# Altium schematic sheet Power_Input_Indicators.SchDoc: Power Inputs and Indicators
size B; CheckedBy: Jason Sullins; Author: Jordan Harris-Toovy; Revision: 0.2; SheetNumber: 4; SheetTotal: 22; Size: ANSI B
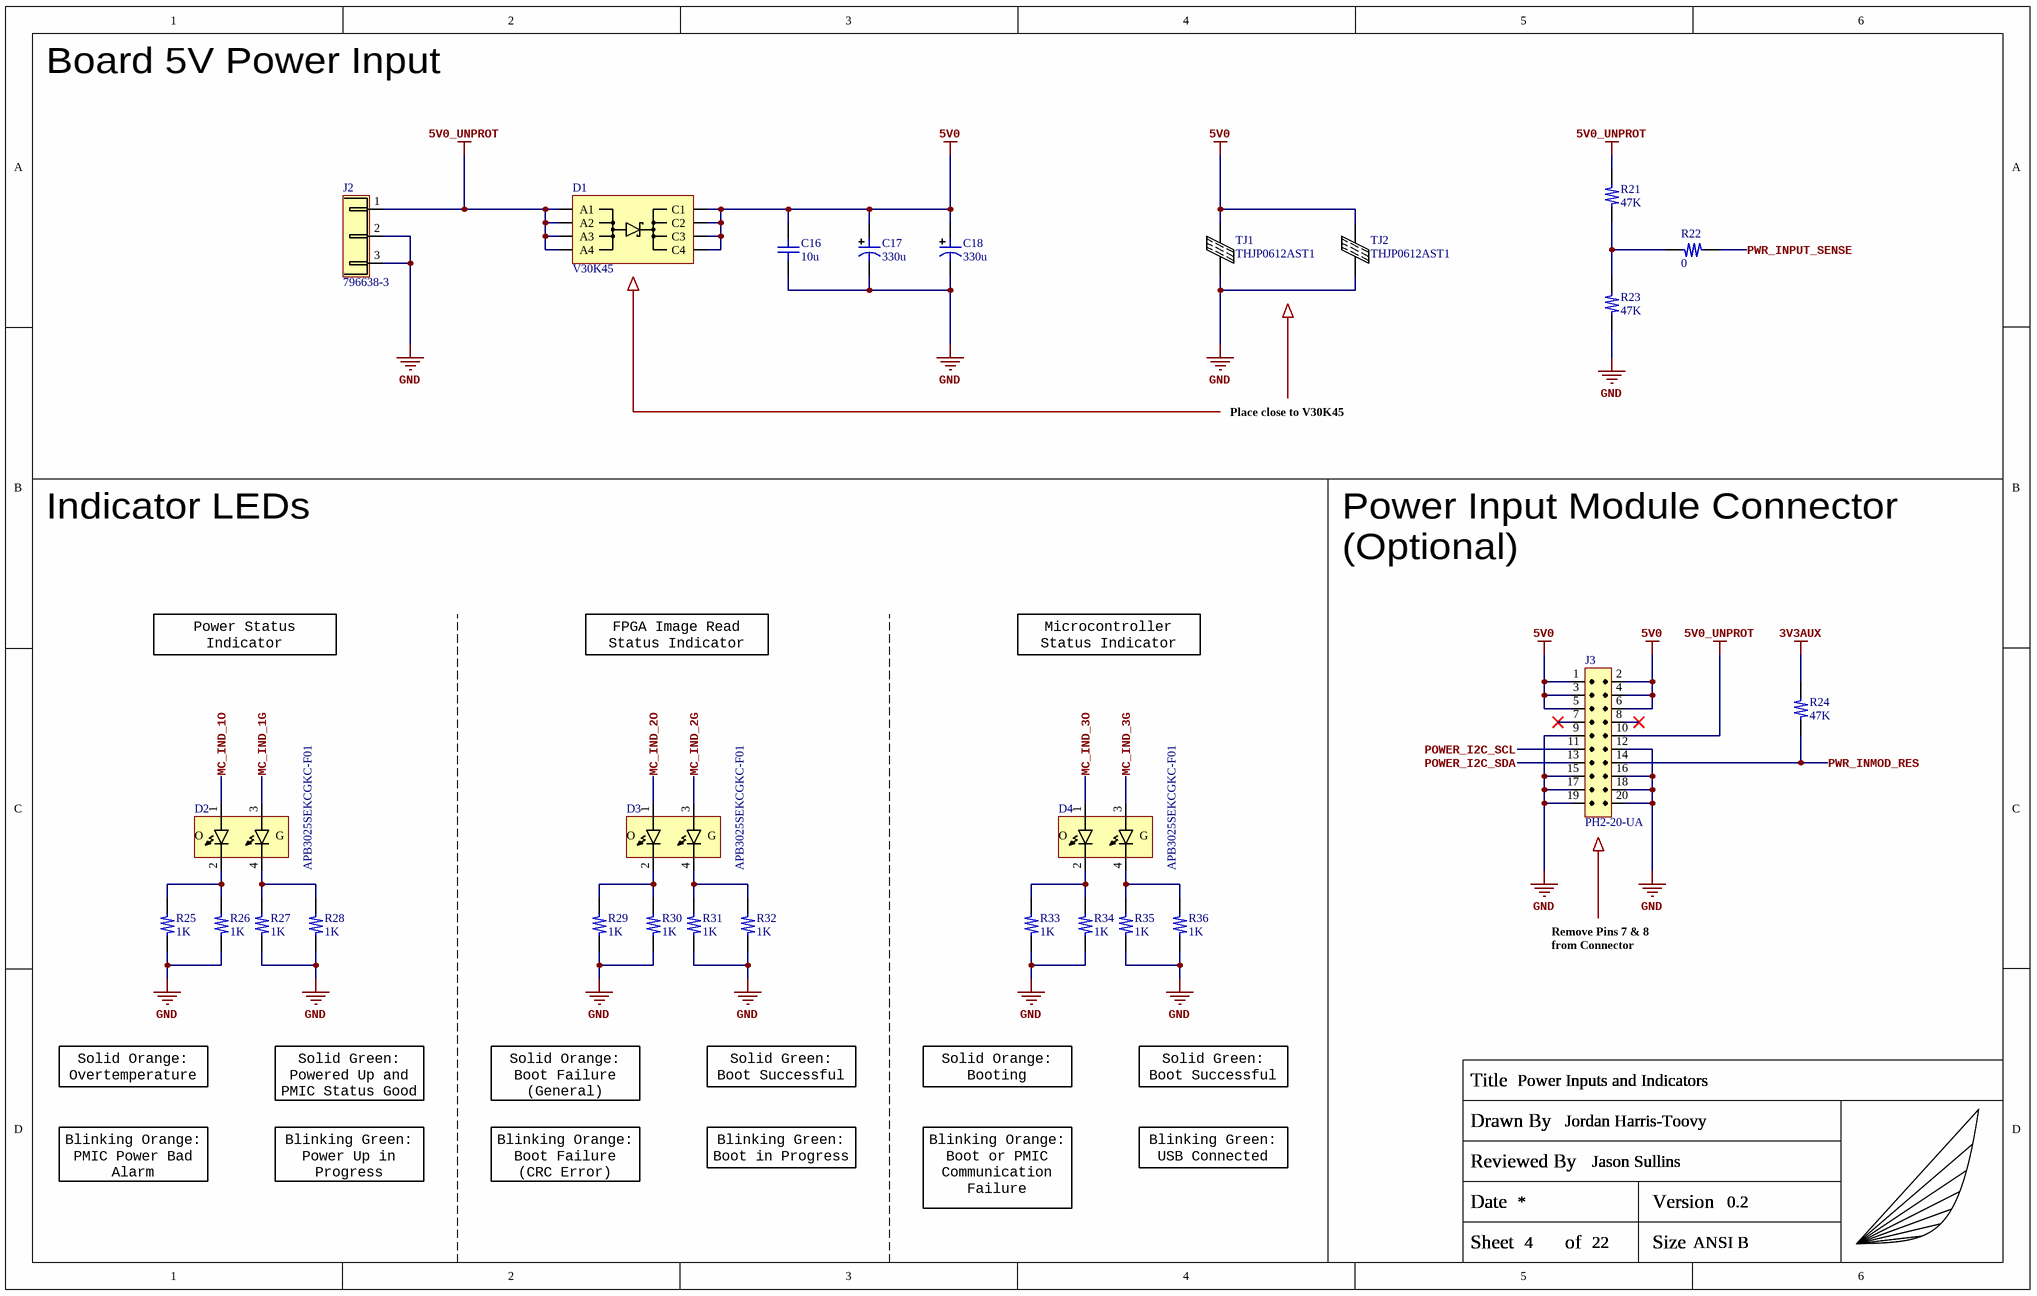
[diagram p0: Power_Input_Indicators.SchDoc]

## Parts
C16  10u  [C_0402_Generic]
C17  330u  [KEMET_EK_Radial]
C18  330u  [KEMET_EK_Radial]
D1  V30K45  [Vishay_FlatPAK_5x6]
D2  APB3025SEKCGKC-F01  [KINGBRIGHT_1210_DUAL]
D3  APB3025SEKCGKC-F01  [KINGBRIGHT_1210_DUAL]
D4  APB3025SEKCGKC-F01  [KINGBRIGHT_1210_DUAL]
J2  796638-3  [TE_796638-3]
J3  PH2-20-UA  [ADAM_TECH_PH2-20-UA]
R21  47K  [R_0402_Generic]
R22  0  [R_0402_Generic]
R23  47K  [R_0402_Generic]
R24  47K  [R_0402_Generic]
R25  1K  [R_0402_Generic]
R26  1K  [R_0402_Generic]
R27  1K  [R_0402_Generic]
R28  1K  [R_0402_Generic]
R29  1K  [R_0402_Generic]
R30  1K  [R_0402_Generic]
R31  1K  [R_0402_Generic]
R32  1K  [R_0402_Generic]
R33  1K  [R_0402_Generic]
R34  1K  [R_0402_Generic]
R35  1K  [R_0402_Generic]
R36  1K  [R_0402_Generic]
TITLEBLOCK?  Capstone_Title_Block  (value not drawn)  (graphical)
TJ1  THJP0612AST1  [ThermaWick_0612]
TJ2  THJP0612AST1  [ThermaWick_0612]

## Nets
3V3AUX: R24.2
5V0: C16.2 C17.1 C18.1 D1.5(C1) D1.6(C2) D1.7(C3) D1.8(C4) J3.1(P1) J3.2(P2) J3.3(P3) J3.4(P4) J3.5(P5) J3.6(P6) TJ1.2(P2) TJ2.2(P2)
5V0_UNPROT: D1.1(A1) D1.2(A2) D1.3(A3) D1.4(A4) J2.1(P1) J3.10(P10) R21.2
GND: C16.1 C17.2 C18.2 J2.2(P2) J2.3(P3) J3.9(P9) J3.12(P12) J3.15(P15) J3.16(P16) J3.17(P17) J3.18(P18) J3.19(P19) J3.20(P20) R23.1 R25.1 R26.1 R27.1 R28.1 R29.1 R30.1 R31.1 R32.1 R33.1 R34.1 R35.1 R36.1 TJ1.1(P1) TJ2.1(P1)
MC_IND_1G: D2.3(A2)
MC_IND_1O: D2.1(A1)
MC_IND_2G: D3.3(A2)
MC_IND_2O: D3.1(A1)
MC_IND_3G: D4.3(A2)
MC_IND_3O: D4.1(A1)
POWER_I2C_SCL: J3.11(P11)
POWER_I2C_SDA: J3.13(P13)
PWR_INMOD_RES: J3.14(P14) R24.1
PWR_INPUT_SENSE: R22.1
NetD2_2: D2.2(C1) R25.2 R26.2
NetD2_4: D2.4(C2) R27.2 R28.2
NetD3_2: D3.2(C1) R29.2 R30.2
NetD3_4: D3.4(C2) R31.2 R32.2
NetD4_2: D4.2(C1) R33.2 R34.2
NetD4_4: D4.4(C2) R35.2 R36.2
NetR21_1: R21.1 R22.2 R23.2

Not connected (* = marked no-connect by the designer): J3 7(P7)* 8(P8)*

## Notes on the sheet
- Board 5V Power Input
- Place close to V30K45
- Indicator LEDs
- Power Input Module Connector
- (Optional)
- Power Status Indicator
- FPGA Image Read Status Indicator
- Microcontroller Status Indicator
- Remove Pins 7 & 8
- from Connector
- Solid Orange: Overtemperature
- Solid Green: Powered Up and PMIC Status Good
- Solid Orange: Boot Failure (General)
- Solid Green: Boot Successful
- Solid Orange: Booting
- Blinking Orange: PMIC Power Bad Alarm
- Blinking Green: Power Up in Progress
- Blinking Orange: Boot Failure (CRC Error)
- Blinking Green: Boot in Progress
- Blinking Green: USB Connected
- Blinking Orange: Boot or PMIC Communication Failure
- (in symbol APB3025SEKCGKC-F01) O; G
- (in symbol Capstone_Title_Block) Title; Drawn By; Reviewed By; Date; Version; Sheet; of; Size

## Library data of the parts
C16 = CC0402MRX5R6BB106: 10µF 10V X5R SMD ceramic capacitor in 0402 size; Manufacturer: YAGEO; Manufacturer Part Number: CC0402MRX5R6BB106
C17 C18 = A759EK337M1AAAE018: 330µF 10V Aluminum polymer capacitor, KEMET EK; Manufacturer: KEMET; Manufacturer Part Number: A759EK337M1AAAE018
D1 = V30K45-M3/H: Schottky Diode 45V 30A FLATPAK, Vishay; Manufacturer: Vishay General Semiconductor; Manufacturer Part Number: V30K45-M3/H
D2-D4 = APB3025SEKCGKC-F01: LED 1210 Green/Orange dual 2.1Vf 160deg 60/300 mcd@20mA; Manufacturer: Kingbright; Manufacturer Part Number: APB3025SEKCGKC-F01
J2 = 796638-3: 3 Position Terminal Block Header, Male Pins, Shrouded / NOTE: Mating wire-to-pin socket is 796635-3; Manufacturer: TE Connectivity; Manufacturer Part Number: 796638-3; Manufacturer2: TE Connectivity; Manufacturer2 Part Number: 796635-3
J3 = PH2-20-UA: THT Header 20 (2x10) position 0.1"; Manufacturer: Adam Tech; Manufacturer Part Number: PH2-20-UA
R21 R23 R24 = ERJ-2RKF4702X: 47KOhm 1% 1/10W SMD resistor in 0402 size; Manufacturer: Panasonic; Manufacturer Part Number: ERJ-2RKF4702X
R22 = ERJ-2GE0R00X: Jumper 0Ohm SMD resistor in 0402 size; Manufacturer: Panasonic; Manufacturer Part Number: ERJ-2GE0R00X
R25-R36 = ERJ-2RKF1001X: 1KOhm 1% 1/10W SMD resistor in 0402 size; Manufacturer: Panasonic; Manufacturer Part Number: ERJ-2RKF1001X
TITLEBLOCK? = Capstone_Title_Block: Custom title block with personal logo; Manufacturer: NONE; Manufacturer Part Number: NONE
TJ1 TJ2 = THJP0612AST1: ThermaWick Thermal Jumper 0612; Manufacturer: Vishay Dale; Manufacturer Part Number: THJP0612AST1